# EAGLE design generator (EAGLE 6.6.0)
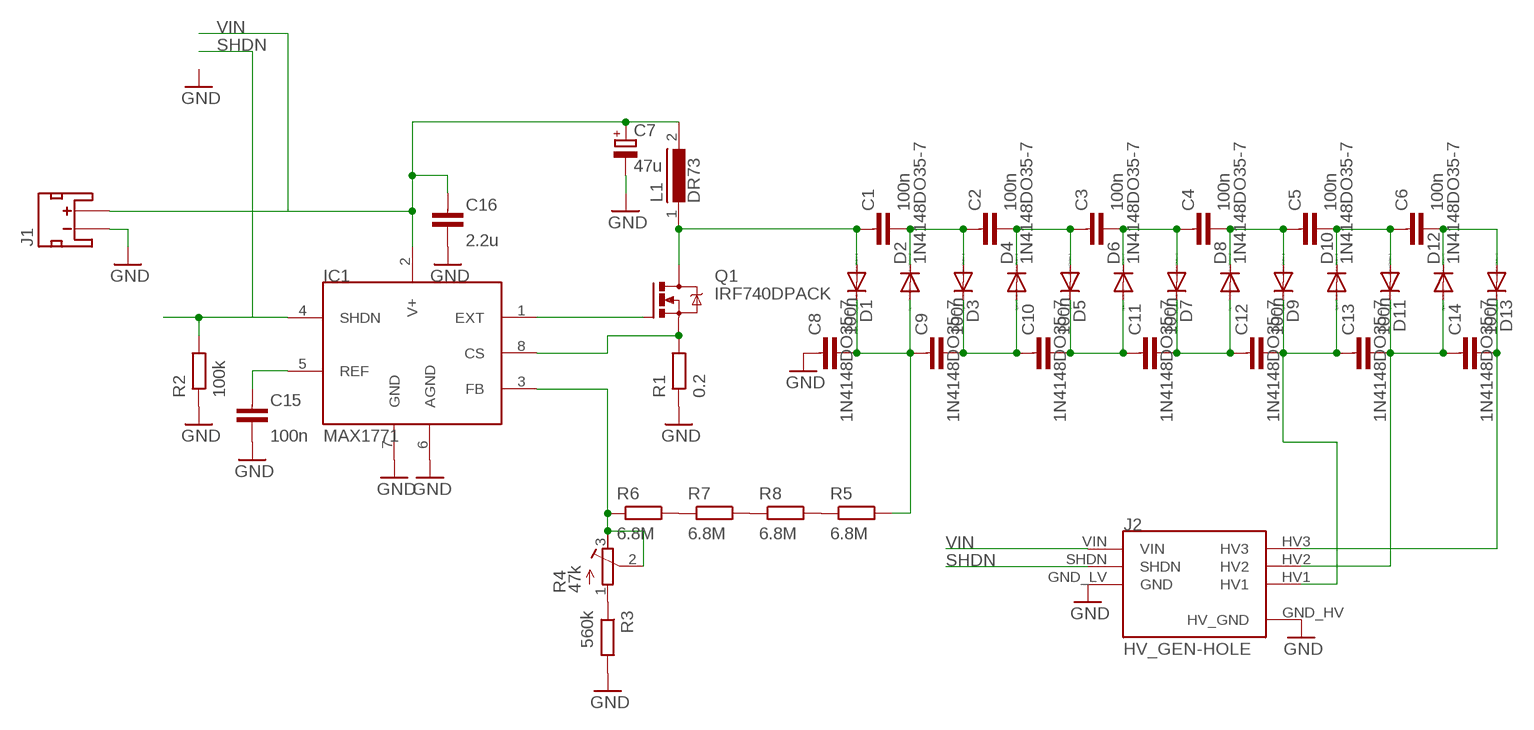
[diagram p0: schematic, sheet 1]

## Parts
C1  100n  CAPACITOR1206-N  [C1206-N]
C2  100n  CAPACITOR1206-N  [C1206-N]
C3  100n  CAPACITOR1206-N  [C1206-N]
C4  100n  CAPACITOR1206-N  [C1206-N]
C5  100n  CAPACITOR1206-N  [C1206-N]
C6  100n  CAPACITOR1206-N  [C1206-N]
C7  47u  CPOL-EUE2-5  [E2-5]
C8  100n  CAPACITOR1206-N  [C1206-N]
C9  100n  CAPACITOR1206-N  [C1206-N]
C10  100n  CAPACITOR1206-N  [C1206-N]
C11  100n  CAPACITOR1206-N  [C1206-N]
C12  100n  CAPACITOR1206-N  [C1206-N]
C13  100n  CAPACITOR1206-N  [C1206-N]
C14  100n  CAPACITOR1206-N  [C1206-N]
C15  100n  CAPACITOR0603-N  [C0603-N]
C16  2.2u  CAPACITOR0603-N  [C0603-N]
D1  1N4148DO35-7  [DO35-7]
D2  1N4148DO35-7  [DO35-7]
D3  1N4148DO35-7  [DO35-7]
D4  1N4148DO35-7  [DO35-7]
D5  1N4148DO35-7  [DO35-7]
D6  1N4148DO35-7  [DO35-7]
D7  1N4148DO35-7  [DO35-7]
D8  1N4148DO35-7  [DO35-7]
D9  1N4148DO35-7  [DO35-7]
D10  1N4148DO35-7  [DO35-7]
D11  1N4148DO35-7  [DO35-7]
D12  1N4148DO35-7  [DO35-7]
D13  1N4148DO35-7  [DO35-7]
IC1  MAX1771  [SO08]
J1  JST_2MM_MALE_TH  [JST-2-TH]
J2  HV_GEN-HOLE  [BRD-LAYOUT2]
L1  DR73  [DR73]
Q1  IRF740DPACK  [DPACK_1]
R1  0.2  RESISTOR0805-N  [R0805-N]
R2  100k  RESISTOR0603-N  [R0603-N]
R3  560k  RESISTOR0603-N  [R0603-N]
R4  47k  R-TRIMM3103  [RTRIM3103]
R5  6.8M  RESISTOR0603-N  [R0603-N]
R6  6.8M  RESISTOR0603-N  [R0603-N]
R7  6.8M  RESISTOR0603-N  [R0603-N]
R8  6.8M  RESISTOR0603-N  [R0603-N]

## Nets
GND: C7.- C8.1 C15.2 C16.2 IC1.6(AGND) IC1.7(GND) J1.2(-) J2.GND_HV(HV_GND) J2.GND_LV(GND) R1.1 R2.1 R3.2
N$1: IC1.8(CS) Q1.E(S) R1.2
N$2: IC1.1(EXT) Q1.B(G)
N$3: C8.2 C9.1 D1.C D2.A R5.2
N$5: C15.1 IC1.5(REF)
N$6: C1.1 D1.A L1.1 Q1.C(D)
N$7: C1.2 C2.1 D2.C D3.A
N$8: C9.2 C10.1 D3.C D4.A
N$9: C2.2 C3.1 D4.C D5.A
N$10: C10.2 C11.1 D5.C D6.A
N$11: C3.2 C4.1 D6.C D7.A
N$12: C11.2 C12.1 D7.C D8.A
N$13: C4.2 C5.1 D8.C D9.A
N$14: C12.2 C13.1 D9.C D10.A J2.HV1
N$15: C5.2 C6.1 D10.C D11.A
N$16: C13.2 C14.1 D11.C D12.A J2.HV2
N$17: IC1.3(FB) R4.2(S) R4.3(E) R6.1
N$18: R5.1 R8.2
N$19: R7.2 R8.1
N$20: R6.2 R7.1
N$23: R3.1 R4.1(A)
N$25: C6.2 D12.C D13.A
N$26: C14.2 D13.C J2.HV3
SHDN: IC1.4(SHDN) J2.SHDN R2.2
VIN: C7.+ C16.1 IC1.2(V+) J1.1(+) J2.VIN L1.2

## Library data of the parts
C1-C6 C8-C14 = passives-7351:CAPACITOR; FARNELL: 1855877
C7 = rcl:CPOL-EU: POLARIZED CAPACITOR, European symbol; FARNELL: 9452460; VOLTAGE: 16V
C15 = passives-7351:CAPACITOR; FARNELL: 2495332
C16 = passives-7351:CAPACITOR; FARNELL: 2496923
D1-D13 = diode:1N4148: DIODE high speed (Philips); FARNELL: 1625213
IC1 = Mine:MAX1771
J1 = dtb:JST_2MM_MALE_TH: Mates to single-cell LiPo batteries. CONN-08352
J2 = generator-lib:HV_GEN
L1 = inductors:DR73: High Power Density, High Efficiency, Shielded Inductors Source: coiltronics_dr_series.pdf; FARNELL: 2061654
Q1 = Mine:IRF740: N-CHANNEL MOS FET; FARNELL: 2453433
R1 = passives-7351:RESISTOR; FARNELL: 2328089
R2 R3 = passives-7351:RESISTOR
R4 = rcl:R-TRIMM: Trimm resistor; FARNELL: 1771727
R5-R8 = passives-7351:RESISTOR; FARNELL: 2138708

## Board
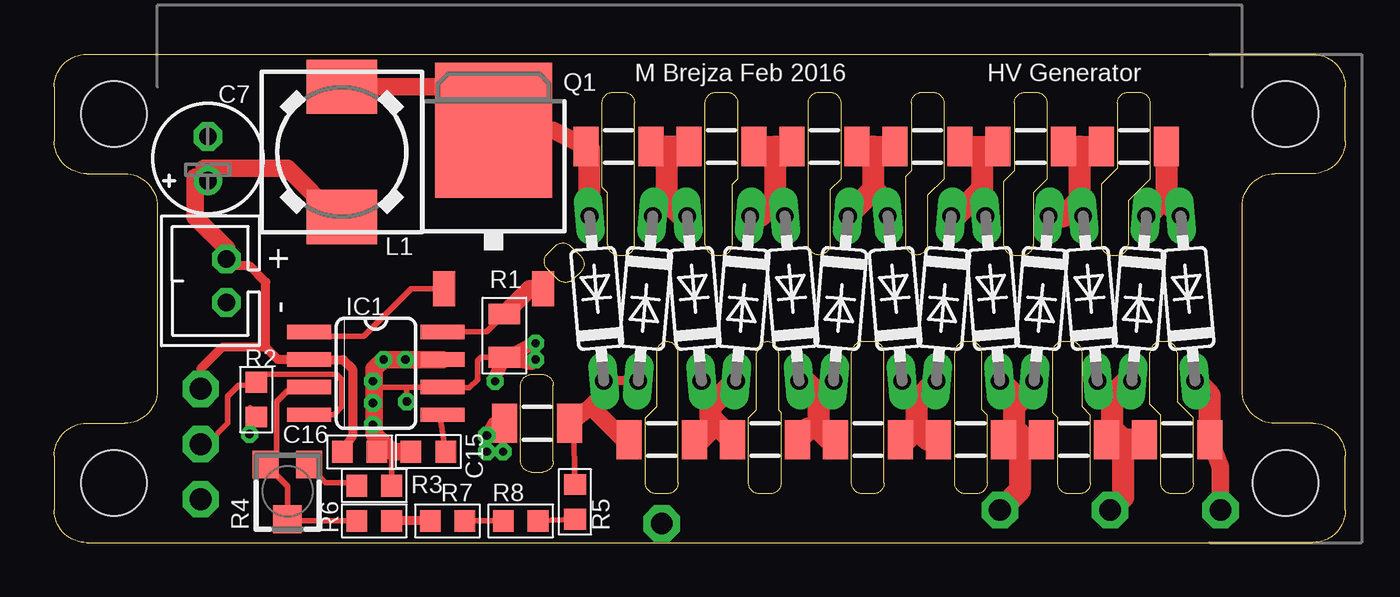
[diagram p1: board, top side]
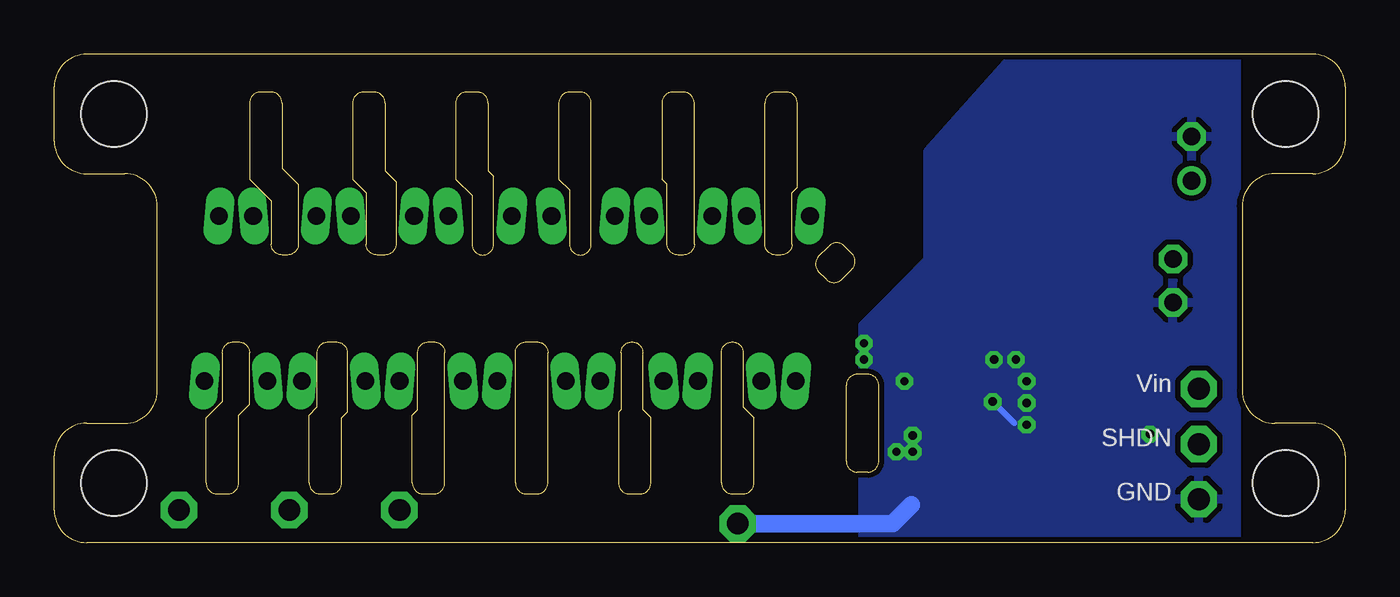
[diagram p2: board, bottom side, seen from below]

Size 59.5 x 22.5 mm. Coordinates in mm from the lower left corner, seen from the top.
Outline: 1.5,0 58,0 arc90 59.5,1.5 59.5,4 arc90 58,5.5 56.25,5.5 arc-90 54.75,7 54.75,15.5 arc-90 56.25,17 58,17 arc90 59.5,18.5 59.5,21 arc90 58,22.5 1.5,22.5 arc90 0,21 0,18.5 arc90 1.5,17 3.25,17 arc-90 4.75,15.5 4.75,7 arc-90 3.25,5.5 1.5,5.5 arc90 0,4 0,1.5 arc90 1.5,0
Outline: 34.75,20.25 arc-90 35.25,20.75 35.75,20.75 arc-90 36.25,20.25 36.25,16.75 35.75,16.25 35.75,13.75 arc-90 35.25,13.25 arc-90 34.75,13.75 34.75,20.25
Outline: 40.25,16 40.25,13.75 arc-90 39.75,13.25 arc-90 39.25,13.75 39.25,16.88 39.5,17.12 39.5,20.25 arc-90 40,20.75 40.5,20.75 arc-90 41,20.25 41,16.75 40.25,16
Outline: 44.25,20.25 arc-90 44.75,20.75 45.25,20.75 arc-90 45.75,20.25 45.75,16.75 45.12,16.12 45.12,13.75 arc-90 44.62,13.25 44.25,13.25 arc-90 43.75,13.75 43.75,16.62 44.25,17.12 44.25,20.25
Outline: 49,20.25 arc-90 49.5,20.75 50,20.75 arc-90 50.5,20.25 50.5,16.75 49.5,15.75 49.5,13.75 arc-90 49,13.25 48.75,13.25 arc-90 48.25,13.75 48.25,16.5 49,17.25 49,20.25
Outline: 30,20.25 arc-90 30.5,20.75 31,20.75 arc-90 31.5,20.25 31.5,16.75 31.25,16.5 31.25,13.75 arc-90 30.75,13.25 30.5,13.25 arc-90 30,13.75 30,20.25
Outline: 25.25,20.25 arc-90 25.75,20.75 26.25,20.75 arc-90 26.75,20.25 26.75,13.75 arc-90 26.25,13.25 26,13.25 arc-90 25.5,13.75 25.5,16.12 25.25,16.38 25.25,20.25
Outline: 28.75,2.75 arc-90 28.25,2.25 27.75,2.25 arc-90 27.25,2.75 27.25,5.75 27.75,6.25 27.75,8.75 arc-90 28.25,9.25 arc-90 28.75,8.75 28.75,2.75
Outline: 33.5,2.75 arc-90 33,2.25 32.5,2.25 arc-90 32,2.75 32,5.75 32.38,6.12 32.38,8.75 arc-90 32.88,9.25 arc-90 33.38,8.75 33.38,6.12 33.5,6 33.5,2.75
Outline: 38.25,2.75 arc-90 37.75,2.25 37.25,2.25 arc-90 36.75,2.75 36.75,8.75 arc-90 37.25,9.25 37.75,9.25 arc-90 38.25,8.75 38.25,2.75
Outline: 43,2.75 arc-90 42.5,2.25 42,2.25 arc-90 41.5,2.75 41.5,8.75 arc-90 42,9.25 42.25,9.25 arc-90 42.75,8.75 42.75,6.12 43,5.88 43,2.75
Outline: 47.75,2.75 arc-90 47.25,2.25 46.75,2.25 arc-90 46.25,2.75 46.25,5.75 46,6 46,8.75 arc-90 46.5,9.25 46.88,9.25 arc-90 47.38,8.75 47.38,6.25 47.75,5.88 47.75,2.75
Outline: 52.5,2.75 arc-90 52,2.25 51.5,2.25 arc-90 51,2.75 51,5.88 50.5,6.38 50.5,8.75 arc-90 51,9.25 51.25,9.25 arc-90 51.75,8.75 51.75,6.5 52.5,5.75 52.5,2.75
Outline: 21.5,3.75 21.5,7.25 arc-90 22,7.75 22.5,7.75 arc-90 23,7.25 23,3.75 arc-90 22.5,3.25 22,3.25 arc-90 21.5,3.75
Outline: 23.21,12.13 22.73,12.6 arc-90 22.73,13.31 23.09,13.66 arc-90 23.79,13.66 24.27,13.19 arc-90 24.27,12.48 23.91,12.13 arc-90 23.21,12.13
Copper layers (1*16): Top 0.035mm / dielectric 1.5mm / Bottom 0.035mm
Design rules "default *": minimum track width 10mil, minimum drill 12mil, track to track 8mil, track to pad 8mil, pad to pad 8mil, via to via 8mil, smd to smd 0mil, copper to edge 10mil, drill to drill 8mil, minimum pad ring 10mil, minimum via ring 8mil, stop-mask expansion 4mil, vias tented up to drill 0mil, thermal gap 10mil

### Footprints (pad centres in the part's own frame; a part is rotated, then mirrored left to right if it is on the bottom)
C1206-N = smd 1.15 x 1.8: 1 -1.5,0; 2 1.5,0
E2-5 = drill 0.813 pad 1.27: + -1.016,0 | drill 0.813 pad 1.27 octagon: - 1.016,0
C0603-N = smd 0.95 x 1: 1 -0.8,0; 2 0.8,0
DO35-7 = drill 0.813 long: A 3.81,0; C -3.81,0
SO08 = smd 0.66 x 2.032: 1 -1.905,-3.073; 2 -0.635,-3.073; 3 0.635,-3.073; 4 1.905,-3.073; 5 1.905,3.073; 6 0.635,3.073; 7 -0.635,3.073; 8 -1.905,3.073
JST-2-TH = drill 0.8 octagon: 1 1,0; 2 -1,0
BRD-LAYOUT2 = drill 1 pad 1.676 octagon: GND_HV 23.25,0.875; HV1 38.837,1.499; HV2 43.917,1.499; HV3 48.997,1.499 | drill 1.016 pad 1.676 octagon: GND_LV 2,2; SHDN 2,4.54; VIN 2,7.08 | hole 3: 52,2.75; 52,19.75; -2,19.75; -2,2.75
DR73 = smd 2.5 x 3.25: 1 -3,0; 2 3,0
DPACK_1 = smd 1 x 1.6: B -2.28,-4.8; E 2.28,-4.8 | smd 5.4 x 6.2: C 0,2.5
R0805-N = smd 0.95 x 1.45: 1 -1,0; 2 1,0
R0603-N = smd 0.95 x 1: 1 -0.8,0; 2 0.8,0
RTRIM3103 = smd 1.2 x 1.25: 1 -1,-1.225; 3 1,-1.225 | smd 1.3 x 1.3: 2 0,1.3

### Placement (x,y rotation side)
C1  26,18.25 0 top
C2  30.75,18.25 0 top
C3  35.5,18.25 0 top
C4  40.25,18.25 0 top
C5  45,18.25 0 top
C6  49.75,18.25 0 top
C7  7.08,17.69 90 top
C8  22.25,5.5 0 top
C9  28,4.75 0 top
C10  32.75,4.75 0 top
C11  37.5,4.75 0 top
C12  42.25,4.75 0 top
C13  47,4.75 0 top
C14  51.75,4.75 0 top
C15  17.24,4.19 180 top
C16  14.07,4.18 0 top
D1  25,11.25 95 top
D2  27.25,11.25 265 top
D3  29.5,11.25 95 top
D4  31.75,11.25 265 top
D5  34,11.25 95 top
D6  36.25,11.25 265 top
D7  38.75,11.25 95 top
D8  41,11.25 265 top
D9  43.25,11.25 95 top
D10  45.5,11.25 265 top
D11  47.75,11.25 95 top
D12  50,11.25 265 top
D13  52.25,11.25 95 top
IC1  14.83,7.8 270 top
J1  7.94,12.06 90 top
J2  4.75,0 0 top
L1  13.25,18 270 top
Q1  20.25,16.5 0 top
R1  20.75,9.54 90 top
R2  9.32,6.59 90 top
R3  14.75,2.62 0 top
R4  10.75,2.38 180 top
R5  24,1.88 90 top
R6  14.75,1 0 top
R7  18.12,1 0 top
R8  21.5,1 0 top

### Tracks (layer width: path | path; a pad name or v marks a point on that pad's centre or on a via)
GND  (via drill 0.38)
  Top 0.254: R1.1 19.66,8.54 19.5,8.38 19.5,7.5 19.12,7.12 17.94,7.12 IC1.6 16.25,7.17 | 16.25,7.17 14.91,7.17 14.75,7 | 9.03,6.22 9.25,6 v9,5 9.29,5.71 R2.1 | v16.25,6.5 16.25,7.17 | R3.2 15.55,3.99 15.75,4.19
  Top 0.406: C16.2 14.94,4.18 15.25,4.5
  Top 0.61: C8.1 20.25,5.5 v19.94,4.93
  Top 0.813: IC1.7 v15.19,8.44 14.75,8 14.75,7 14.75,5 15.25,4.5 15.56,4.19 15.75,4.19 C15.2
  Bottom 0.254: 15.25,5.5 v16.25,6.5
  Bottom 0.813: J2.GND_HV 20.88,0.88 20,1.75
  other vias: 20.69,4.18 19.94,4.18 22.18,9.19 22.18,8.44 20.31,7.43 16.19,8.44 14.69,7.43 14.69,6.43 14.69,5.43
  pour Bottom (isolate 0.254): 5,22.5 15.25,22.5 19.25,18 19.25,13 22.25,10 22.25,-0.5 4.25,-0.5 5,0.5
N$1
  Top 0.254: IC1.8 19.91,9.71 R1.2
  Top 0.813: Q1.E 21.91,11.7 R1.2
N$2
  Top 0.254: Q1.B 16.45,11.7 14.25,9.5 11.96,9.5 IC1.1
N$3
  Top 0.254: R5.2 23.93,5.33 C8.2
  Top 0.406: D2.A D1.C
  Top 0.813: C8.2 24.75,6.25 | 24.75,6.25 25.25,6.75 25.25,7.37 D1.C | C9.1 26.25,4.75 24.75,6.25
N$5
  Top 0.254: C15.1 17.79,5.78 IC1.5
N$6
  Top 0.813: L1.1 19.75,21 20.75,20 20.75,19.5 Q1.C 23,19 C1.1
  Top 1.016: D1.A 24.67,18.08 C1.1
N$7
  Top 1.016: C2.1 28.25,18.25 | 28.25,18.25 C1.2 | D3.A 28.95,15.05 28.25,15.75 | 28.25,15.75 28.25,15.71 D2.C | 28.25,15.75 28.25,18.25
N$8
  Top 1.016: C10.1 30.5,5.5 | 30.5,5.5 30.25,5.75 30.25,6.29 30.48,6.52 | 30.48,6.52 D4.A | D3.C 29.83,7.17 30.48,6.52 | C9.2 29.75,4.75 30.5,5.5
N$9
  Top 1.016: C2.2 33.25,18.25 | 33.25,18.25 C3.1 | D5.A 33.67,15.33 33.25,15.75 | 33.25,15.75 33.25,18.25 | D4.C 32.55,15.05 33.25,15.75
N$10
  Top 1.016: C11.1 35.75,4.75 35.25,5.25 | 35.25,5.25 35.25,6.79 | 35.25,6.79 D6.A | D5.C 34.58,7.45 35.25,6.79 | 35.25,5.25 34.75,5.25 C10.2
N$11
  Top 1.016: C3.2 37.75,18.25 | 37.75,18.25 C4.1 | D7.A 38.42,15.58 37.75,16.25 | 37.75,16.25 37.75,18.25 | D6.C 36.58,15.08 37.75,16.25
N$12
  Top 1.016: C12.1 40.25,4.75 39.75,5.25 | 39.75,5.25 39.75,6.54 | 39.75,6.54 D8.A | D7.C 39.08,7.21 39.75,6.54 | C11.2 39.25,4.75 39.75,5.25
N$13
  Top 1.016: C4.2 C5.1 43.25,18.25 42.75,17.75 42.75,16.25 | 42.75,16.25 42.75,15.21 D9.A | D8.C 41.55,15.05 42.75,16.25
N$14
  Top 0.813: 44.5,4.5 44.25,4.75
  Top 1.016: D10.A 45.17,7.17 44.25,6.25 | 44.25,6.25 44.25,6.79 D9.C | C13.1 44.75,4.75 44.5,5 | 44.5,5 44.25,5.25 44.25,6.25 | C12.2 44.25,4.75 44.5,5 | 44.5,4.5 44.5,2.41 J2.HV1
N$15
  Top 1.016: C5.2 47.25,18.25 | 47.25,18.25 47.25,15.75 | 47.25,15.75 47.25,15.21 D11.A | D10.C 46.55,15.05 47.25,15.75 | 47.25,18.25 C6.1
N$16
  Top 0.61: 49.25,4.5 49.5,4.75
  Top 1.016: D12.A 49.45,7.45 48.75,6.75 | 48.75,6.75 48.75,5.25 | 48.75,5.25 48.75,5 C13.2 | C14.1 49.5,4.75 49.25,4.75 48.75,5.25 | D11.C 48.08,7.42 48.75,6.75 | 49.25,4.5 49.25,2.08 J2.HV2
N$17
  Top 0.254: IC1.3 11.59,7 10.75,7 10.25,6.5 10.25,4.1 R4.3 10.75,2.6 R4.2 10.82,1 R6.1
N$18
  Top 0.254: R8.2 R5.1
N$19
  Top 0.254: R7.2 R8.1
N$20
  Top 0.406: R7.1 R6.2
N$21
  Top 0.61: 20.25,7.5 20.75,8.5 | 22,8.25 20.75,8.5 | 22.25,9.25 20.75,8.5
N$23
  Top 0.254: R4.1 11.75,3.5 12.5,2.75 13.82,2.75 R3.1
N$25
  Top 1.016: C6.2 51.25,15.96 51.14,15.86 | 51.14,15.86 D12.C | D13.A 51.92,15.08 51.14,15.86
N$26
  Top 0.813: J2.HV3 53.75,3.5 C14.2
  Top 1.016: C14.2 53.25,6.79 D13.C
SHDN
  Top 0.254: IC1.4 12.89,5.89 13.25,6.25 13.25,7.5 13,7.75 9.68,7.75 R2.2 9.18,7.25 8.5,7.25 8,6.75 8,5.5 7.04,4.54
  Top 0.406: J2.SHDN 7.04,4.54
VIN
  Top 0.406: C16.1 13.75,4.91 13.75,8 13.31,8.44 IC1.2 10.32,8.44 9.75,9 | 9.75,9 9.75,12 9,12.75 8,12.75 J1.1 | 9.75,9 7.75,9 6.75,8 J2.VIN
  Top 0.813: J1.1 7.94,13.56 6.5,15 6.5,16.84 C7.+ 6.91,17.25 10.75,17.25 13,15 L1.2

### Text on the board
tPlace: M Brejza Feb 2016 | HV Generator
bPlace: Vin | SHDN | GND